# Altium schematic sheet INPUT.SchDoc
size Letter; SheetNumber: 4; SheetTotal: 4
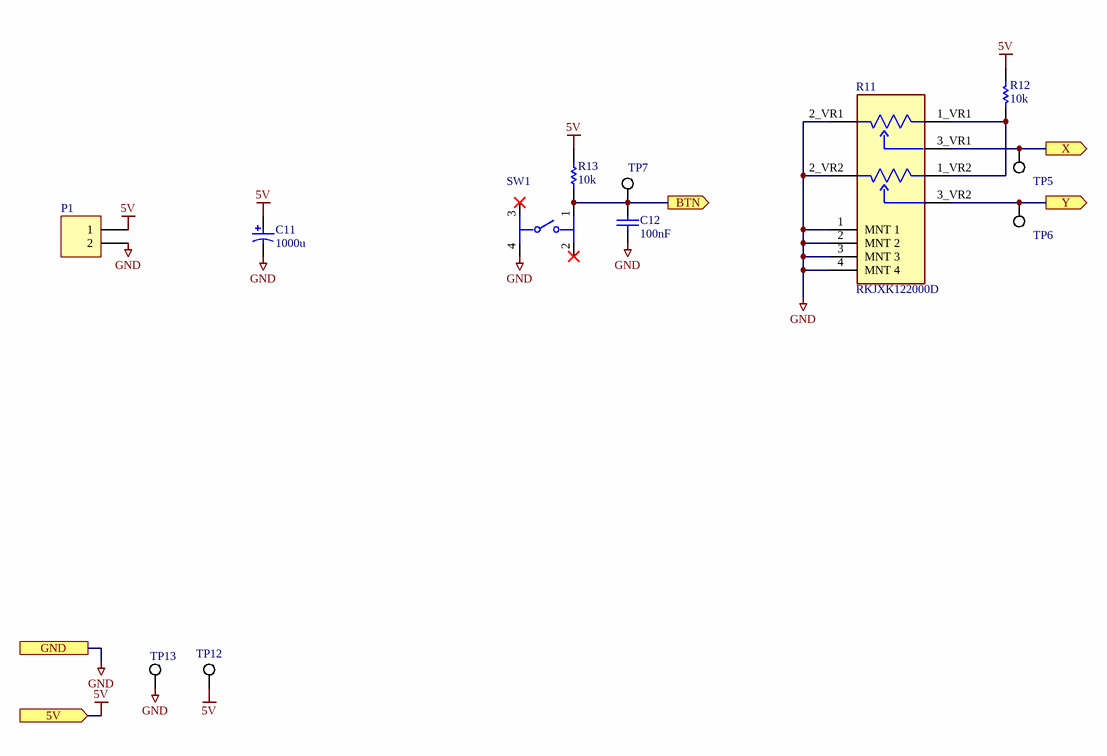
[diagram p0: INPUT.SchDoc]

## Parts
C11  1000u  [NIC-CAPA2-10X10_V]
C12  100nF  [CAPC1005X56X25ML10T15]
P1  Header 2  [HDR1X2]  (value not drawn)
R11  RKJXK122000D  [FP-RKJXK122000D-MFG]
R12  10k  [RESC1005X40X25LL05T05]
R13  10k  [RESC1005X40X25LL05T05]
SW1  PTS645SM43SMTR92LFS  [FP-PTS645SM43SMTR92LFS-MFG]  (value not drawn)
TP5  5019  [KSTN-5019_V]  (value not drawn)
TP6  5019  [KSTN-5019_V]  (value not drawn)
TP7  5019  [KSTN-5019_V]  (value not drawn)
TP12  5019  [KSTN-5019_V]  (value not drawn)
TP13  5019  [KSTN-5019_V]  (value not drawn)

## Ports
5V (in), BTN (out), GND, X (out), Y (out)

## Nets
5V: C11.1 P1.1 R12.2 R13.2 TP12.1 ; port 5V
GND: C11.2 C12.2 P1.2 R11.1(MNT_1) R11.2(MNT_2) R11.2_VR1(2_VR1) R11.2_VR2(2_VR2) R11.3(MNT_3) R11.4(MNT_4) SW1.4 TP13.1 ; port GND
BTN: C12.1 R13.1 SW1.1 TP7.1 ; port BTN
X: R11.3_VR1(3_VR1) TP5.1 ; port X
Y: R11.3_VR2(3_VR2) TP6.1 ; port Y
NetR11_1_VR1: R11.1_VR1(1_VR1) R11.1_VR2(1_VR2) R12.1

Not connected (* = marked no-connect by the designer): SW1 2* 3*

## Notes on the sheet
- SHEET
- REVISION
- OF
- PROJECT
- REVIEWER
- ENGINEER
- DATE

## Library data of the parts
C11 = CMP-0687-00006-1: Aluminum Electrolytic Capacitor, UD Series, Low Impedance, 1000 uF, 10 V, + / - 20%, -55 to 105 degC, Chip Type, 10 x 10 mm D x L, Pb-Free, Reel; Manufacturer: Nichicon; PartNumber: UUD1A102MNL1GS; Rated Voltage: 10 V; Rated Capacitance: 1000 uF; Endurance Time: 5000 h; Impedance: 0.09 Ohm; Packing: Dia382mm Reel; Tolerance Rated Capacitance: -20 to 20%; Rated Ripple Current (at 100kHz): 670 mA; DatasheetVersion: 08/2012; PackageReference: CAPAE-D10H10; PackageDescription: 2-Pin Surface Mount Device, Diameter 10 mm, Height 10 mm, Pitch 8 mm; ComponentLink3URL: http://products.nichicon.co.jp/en/pdf/XJA043/e-ud.pdf; ComponentLink2Description: Datasheet; Diameter: 10 mm; ComponentLink1Description: Manufacturer URL; RoHS: TRUE; ComponentLink2URL: http://products.nichicon.co.jp/en/pdf/XJA043/e-ud.pdf; Length: 10 mm; ComponentLink1URL: http://www.nichicon.co.jp/; Mounting Technology: Surface Mount; ComponentLink3Description: Package Specification
C12 = CMP-1034-02071-2: Manufacturer: AVX Interconnect / Elco; Part Number: 0402YG104ZAT2A
P1 = Header 2: Header, 2-Pin; LatestRevisionDate: 17-Jul-2002; LatestRevisionNote: Re-released for DXP Platform.; Publisher: Altium Limited
R11 = CMP-24118-000003-1: ALPS NAVIGATION SWITCH, RESISTIVE, PCB; Life (Hours): 100Hour; Operating Force: 5.2N; Resistance: 10kR; Insulation Resistance: 100MR; Power Rating: 12.5mW; Current Rating: 50mA; Lead Free: Lead Free; Mount: Through Hole; Resistor Type: Potentiometer; Min Operating Temperature: -10°C; Series: RKJXV/ RKJXK; Military Standard: Not; Width: 16mm; Length: 16mm; Max Operating Temperature: 70°C; Package Quantity: 10; Height: 12.9mm; Type: Potentiometer; Packaging: Tray; Radiation Hardening: No; Termination: Pin; RoHS Compliant: Yes; Depth: 20.7mm
R12 R13 = CMP-2000-07588-1: Chip Resistor, 10 KOhm, +/- 1%, 0.1 W, -55 to 155 degC, 0402 (1005 Metric), RoHS, Tape and Reel; Manufacturer: Panasonic; Power Rating: 100mW; Voltage Rating: 50V; Resistance: 10KOhm; Case\/Package: 0402; Temperature Coefficient: 100ppm\/degreesC; RoHSCompliant: True; Lead Free: LeadFree; Package Quantity: 1; Contact Plating: Tin; Length: 1mm; Radiation Hardening: No; REACH SVHC: NoSVHC; Max Operating Temperature: 155degC; Depth: 0.5mm; Case Code (Imperial): 0402; Military Standard: Not; Package Description: 2-Pin Surface Mount Device, Body 1 x 0.5 mm; Termination: SMD/SMT; Case Code (Metric): 1005; Height: 0.35mm; Packaging: TapeandReel; Voltage Rating (DC): 50V; Package Reference: 402; Number of Pins: 2; Tolerance: 1%; Mounting Technology: SurfaceMount; Width: 0.02inch; Mount: SurfaceMount; Datasheet URL: https://industrial.panasonic.com/cdbs/www-data/pdf/RDA0000/AOA0000C304.pdf; Composition: ThickFilm; Datasheet Version: 02/2017; Manufacturer URL: http://www.panasonic.com/; Max Power Dissipation: 100mW; Number of Terminations: 2; Min Operating Temperature: -55degC
SW1 = CMP-2000-05160-2: SWITCH TACTILE SPST-NO 0.05A 12V; Contact Resistance: 100mR; Throw Configuration: SPST; Illumination Type: Non-Illuminated; Mechanical Life: 100000Cycles; Current Rating: 50mA; Switch Function: Off-Mom; Actuator Length: 0.85mm; Actuator Material: Nylon; Actuator Type: Standard; Operating Force: 160gf; Min Operating Temperature: -20°C; REACH SVHC: No SVHC; Termination: Gull Wing; Case/Package: SMD/SMT; Packaging: Tape and Reel; Mount: Surface Mount; Voltage Rating (DC): 12V; Orientation: Straight; Lead Free: Lead Free; Contact Material: Silver; Color: Black; Max Current Rating: 50mA; Contact Plating: Silver; Depth: 9mm; Package Quantity: 1; Max Voltage Rating (DC): 12V; Length: 6mm; Max Operating Temperature: 60°C
TP5-TP7 TP12 TP13 = CMP-1672-00008-1: Test Point, 1 Position SMD, RoHS, Tape and Reel; ComponentLink1Description: Manufacturer URL; Package Quantity: 1000; DatasheetVersion: 03/2014; Packaging: Tape and Reel; ComponentLink2URL: http://www.keyelco.com/product-pdf.cfm?p=1357; ComponentLink1URL: http://www.keyelco.com/; Mount: Surface Mount; Contact Plating: Silver; PackageDescription: 1-Pin Surface Mount Device, Body 3.81 x 2.03 mm; Pins: 1; RoHSCompliant: True; Mounting Technology: Surface Mount; ComponentLink2Description: Datasheet; PackageReference: 5019